# EAGLE design untitled (EAGLE 5.10)
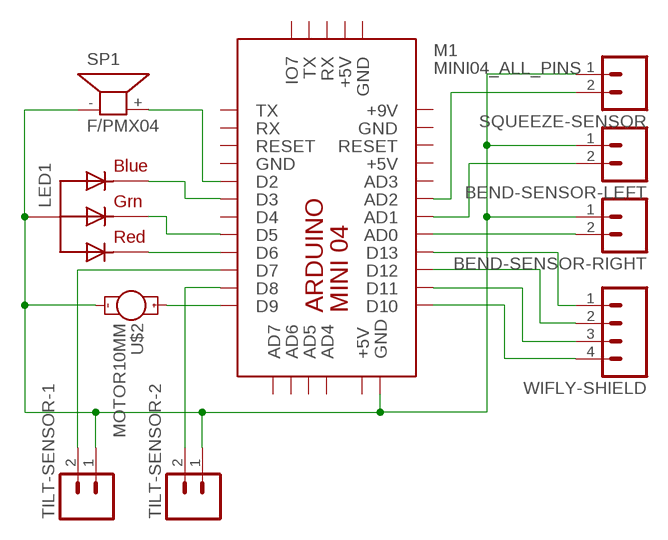
[diagram p0: schematic, sheet 1]

## Parts
BEND-SENSOR-LEFT  M02LOCK  [1X02_LOCK]
BEND-SENSOR-RIGHT  M02LOCK  [1X02_LOCK]
LED1  RGBLED_CA-5MM  [LED5MMRGB]
M1  MINI04_ALL_PINS  [MINI04_ALL_PINS]
SP1  F/PMX04  [F/PMX04A]
SQUEEZE-SENSOR  M02LOCK  [1X02_LOCK]
TILT-SENSOR-1  M02LOCK  [1X02_LOCK]
TILT-SENSOR-2  M02LOCK  [1X02_LOCK]
U$2  MOTOR10MM  [VIBE-MOTOR-10MM]
WIFLY-SHIELD  M04PTH  [1X04]

## Nets
N$1: M1.D10 WIFLY-SHIELD.4
N$2: LED1.1(RED) M1.D6
N$3: LED1.3(GREEN) M1.D5
N$4: LED1.4(BLUE) M1.D3
N$5: M1.D9 U$2.+
N$6: M1.D2 SP1.+
N$7: BEND-SENSOR-RIGHT.2 M1.AD0
N$8: BEND-SENSOR-LEFT.2 M1.AD1
N$9: M1.AD2 SQUEEZE-SENSOR.2
N$10: BEND-SENSOR-LEFT.1 BEND-SENSOR-RIGHT.1 LED1.2(VCC) M1.GND@3(GND) SP1.- SQUEEZE-SENSOR.1 TILT-SENSOR-1.1 TILT-SENSOR-2.1 U$2.-
N$11: M1.D11 WIFLY-SHIELD.3
N$12: M1.D12 WIFLY-SHIELD.2
N$13: M1.D13 WIFLY-SHIELD.1
N$14: M1.D7 TILT-SENSOR-1.2
N$15: M1.D8 TILT-SENSOR-2.2
Unconnected: M1.AD3 M1.AD4 M1.AD5 M1.AD6 M1.AD7 M1.D4 M1.IO7 M1.RESET@1(RESET) M1.RESET@2(RESET) M1.RX@1(RX) M1.RX@2(RX) M1.TX@1(TX) M1.TX@2(TX)

## Power pins joined to a net without a drawn wire
+5V: M1.+5V@1(+5V) M1.+5V@2(+5V) M1.+5V@3(+5V)
+9V: M1.+9V
GND: M1.GND@1(GND) M1.GND@2(GND) M1.GND@4(GND)

## Library data of the parts
BEND-SENSOR-LEFT BEND-SENSOR-RIGHT SQUEEZE-SENSOR TILT-SENSOR-1 TILT-SENSOR-2 = SparkFun:M02: Header 2 Standard 2-pin 0.1" header. Use with straight break away headers (SKU : PRT-00116), right angle break away headers (PRT-00553), swiss pins (PRT-00743), machine pins (PRT-00117), and female headers (PRT-00115). Molex polarized connector foot print use with SKU : PRT-08233 with associated crimp pins and housings.
LED1 = adafruit:RGBLED_CA: RGB LED, common-anode 5MM Staggered pins 5mm Piranha package http://www.ladyada.net/library/pcb/eaglelibrary.html
M1 = arduino:MINI04_ALL_PINS
SP1 = buzzer:F/PMX04: SPEAKER Source: Buerklin
U$2 = SparkFun:MOTOR: Vibration Motor Physical dimension and wire connections for this powerful vibration motor. Motor has a self adhesive backing. Spark Fun Electronics SKU : ROB-08449
WIFLY-SHIELD = SparkFun:M04: Header 4 Standard 4-pin 0.1" header. Use with straight break away headers (SKU : PRT-00116), right angle break away headers (PRT-00553), swiss pins (PRT-00743), machine pins (PRT-00117), and female headers (PRT-00115). Molex polarized connector foot print use with SKU : PRT-08231 with associated crimp pins and housings.

## Board
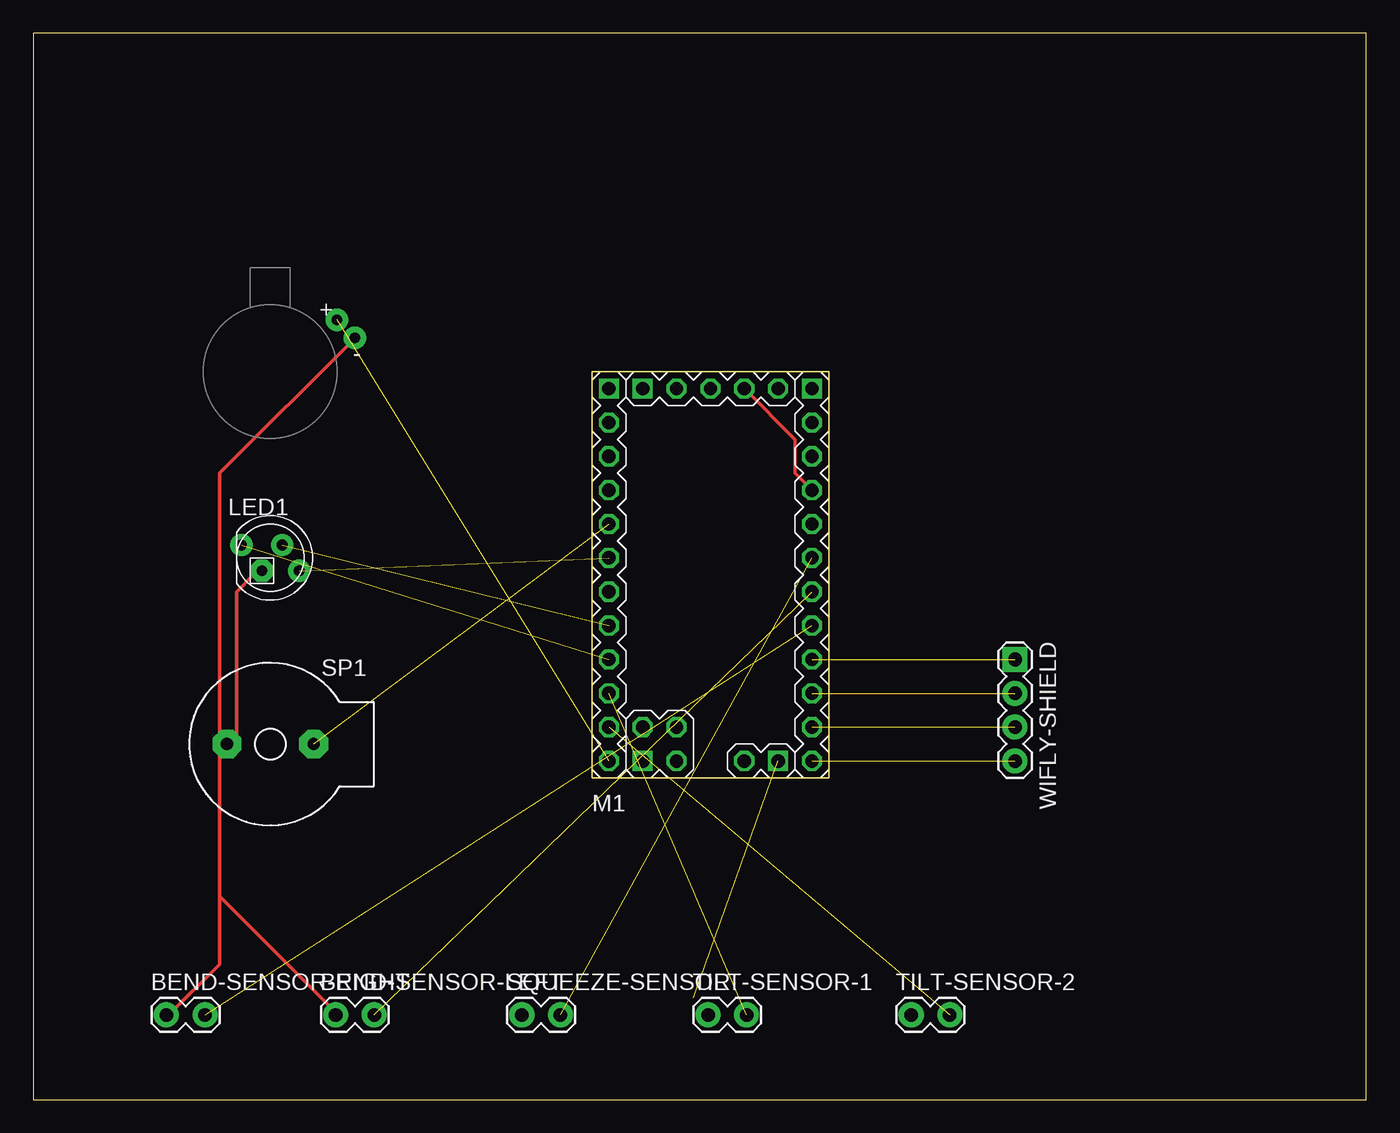
[diagram p1: board, top side]
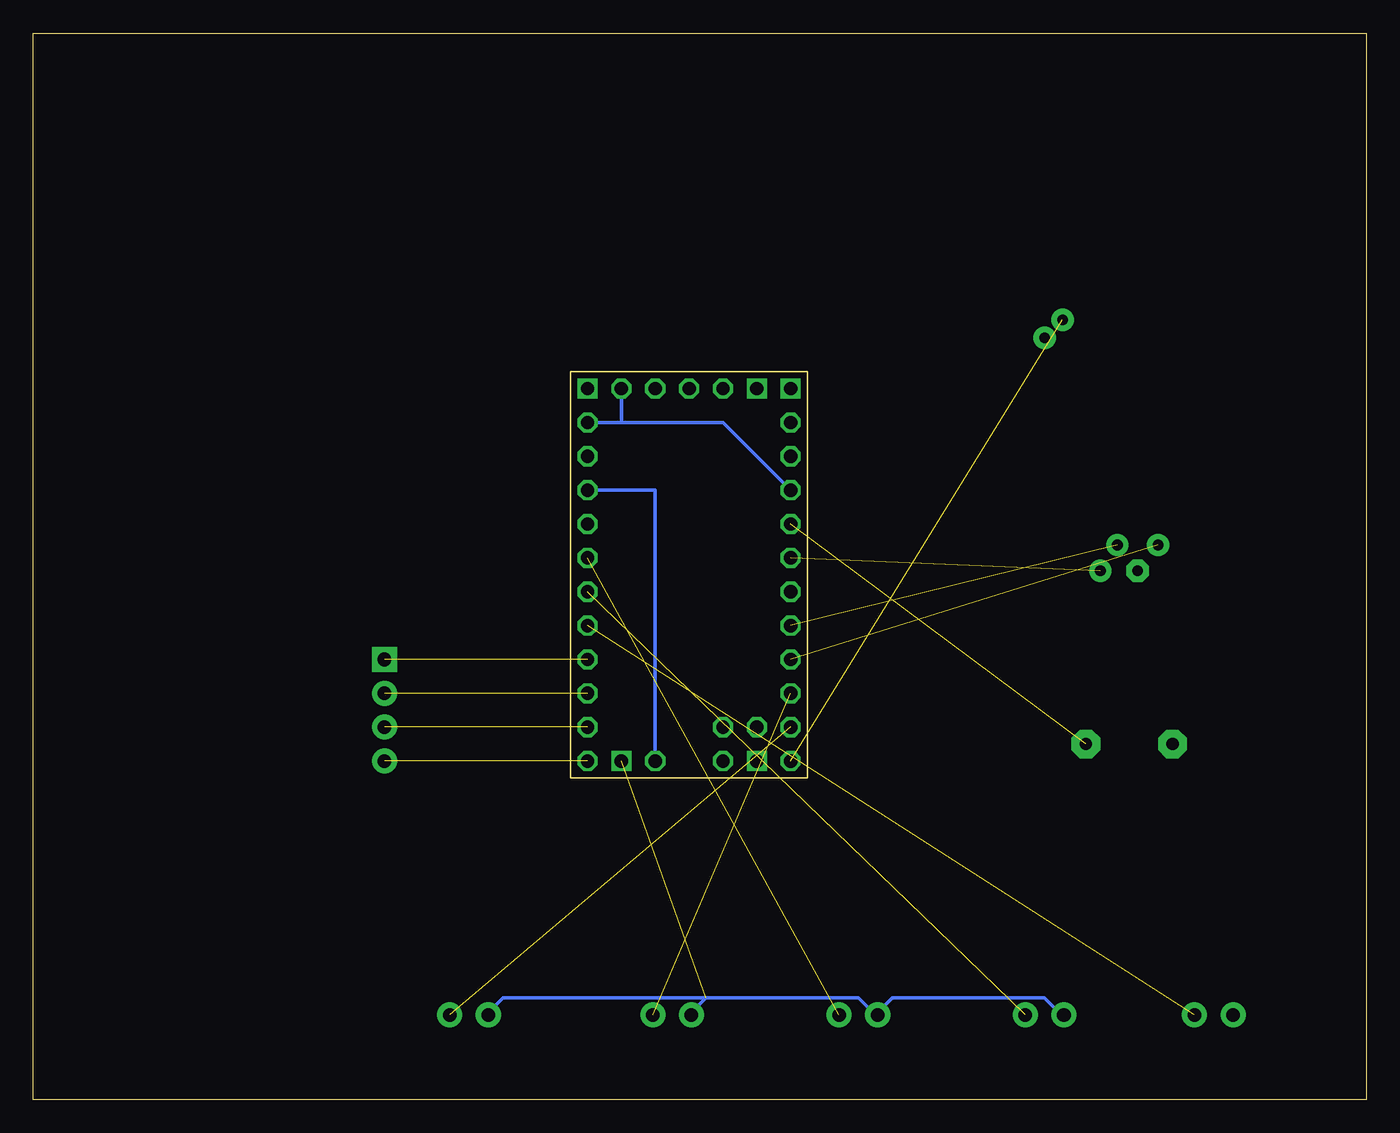
[diagram p2: board, bottom side, seen from below]

Size 100 x 80 mm. Coordinates in mm from the lower left corner, seen from the top.
Outline: 0,0 100,0 100,80 0,80 0,0
Copper layers (1*16): Top 0.035mm / dielectric 1.5mm / Bottom 0.035mm
Design rules "default": minimum track width 10mil, minimum drill 24mil, track to track 8mil, track to pad 8mil, pad to pad 8mil, via to via 8mil, smd to smd 8mil, copper to edge 40mil, drill to drill 8mil, minimum pad ring 10mil, minimum via ring 8mil, stop-mask expansion 4mil, vias tented up to drill 0mil, thermal gap 10mil

### Footprints (pad centres in the part's own frame; a part is rotated, then mirrored left to right if it is on the bottom)
1X02_LOCK = drill 1.016 pad 1.88 round: 1 -0.178,0; 2 2.718,0
LED5MMRGB = drill 0.8 pad 1.676 round: 1 -2.159,0.968; 3 0.889,0.968; 4 2.159,-0.968 | drill 0.8 pad 1.676 octagon: 2 -0.635,-0.968
MINI04_ALL_PINS = drill 1 octagon: +5V@1 10.16,0; +5V@2 5.08,-20.32; +5V@3 5.08,7.62; AD0 10.16,-10.16; AD1 10.16,-7.62; AD2 10.16,-5.08; AD3 10.16,-2.54; AD5 0,-20.32; AD6 -2.54,-17.78; AD7 0,-17.78; D2 -5.08,-2.54; D3 -5.08,-5.08; D4 -5.08,-7.62; D5 -5.08,-10.16; D6 -5.08,-12.7; D7 -5.08,-15.24; D8 -5.08,-17.78; D9 -5.08,-20.32; D10 10.16,-20.32; D11 10.16,-17.78; D12 10.16,-15.24; D13 10.16,-12.7; GND@1 -5.08,0; GND@2 10.16,5.08; GND@4 7.62,7.62; RESET@1 -5.08,2.54; RESET@2 10.16,2.54; RX@1 -5.08,5.08; RX@2 2.54,7.62; TX@2 0,7.62 | drill 1 square: +9V 10.16,7.62; AD4 -2.54,-20.32; GND@3 7.62,-20.32; IO7 -2.54,7.62; TX@1 -5.08,7.62
F/PMX04A = drill 0.914 pad 2.159 octagon: + 3.251,0; - -3.251,0
VIBE-MOTOR-10MM = drill 0.8 pad 1.676 round: + -5,-3.9; - -6.35,-2.54
1X04 = drill 1.016 pad 1.88 square: 1 0,0 | drill 1.016 pad 1.88 round: 2 2.54,0; 3 5.08,0; 4 7.62,0

### Placement (x,y rotation side)
BEND-SENSOR-LEFT  22.86,6.35 0 top
BEND-SENSOR-RIGHT  10.16,6.35 0 top
LED1  17.78,40.64 0 top
M1  48.26,45.72 0 top
SP1  17.78,26.67 0 top
SQUEEZE-SENSOR  36.83,6.35 0 top
TILT-SENSOR-1  50.8,6.35 0 top
TILT-SENSOR-2  66.04,6.35 0 top
U$2  17.78,54.61 180 top
WIFLY-SHIELD  73.66,33.02 270 top

### Tracks (layer width: path | path; a pad name or v marks a point on that pad's centre or on a via)
+5V
  Top 0.254: M1.+5V@3 57.15,49.53 57.15,46.99 M1.+5V@1
  Bottom 0.254: M1.+5V@2 53.34,45.72 M1.+5V@1
GND
  Bottom 0.254: M1.GND@1 48.26,50.8 55.88,50.8 | 55.88,50.8 M1.GND@2 | 55.88,50.8 M1.GND@4
N$1  (1 unrouted)
N$2  (1 unrouted)
N$3  (1 unrouted)
N$4  (1 unrouted)
N$5  (1 unrouted)
N$6  (1 unrouted)
N$7  (1 unrouted)
N$8  (1 unrouted)
N$9  (1 unrouted)
N$10  (1 unrouted)
  Top 0.254: LED1.2 16.51,39.37 15.24,38.1 15.24,26.67 SP1.- 13.97,26.67 | U$2.- 13.97,46.99 13.97,26.67 | 13.97,15.24 13.97,26.67 | 13.97,15.24 13.97,10.16 10.16,6.35 BEND-SENSOR-RIGHT.1 | 13.97,15.24 22.86,6.35 BEND-SENSOR-LEFT.1
  Bottom 0.254: 36.83,6.35 38.1,7.62 49.53,7.62 | 49.53,7.62 50.8,6.35 TILT-SENSOR-1.1 | 49.53,7.62 64.77,7.62 66.04,6.35 TILT-SENSOR-2.1 | 36.83,6.35 35.56,7.62 24.13,7.62 22.86,6.35 BEND-SENSOR-LEFT.1 | 36.83,6.35 SQUEEZE-SENSOR.1
N$11  (1 unrouted)
N$12  (1 unrouted)
N$13  (1 unrouted)
N$14  (1 unrouted)
N$15  (1 unrouted)